# EAGLE design BuckConverterSchematic (EAGLE 9.2.0)
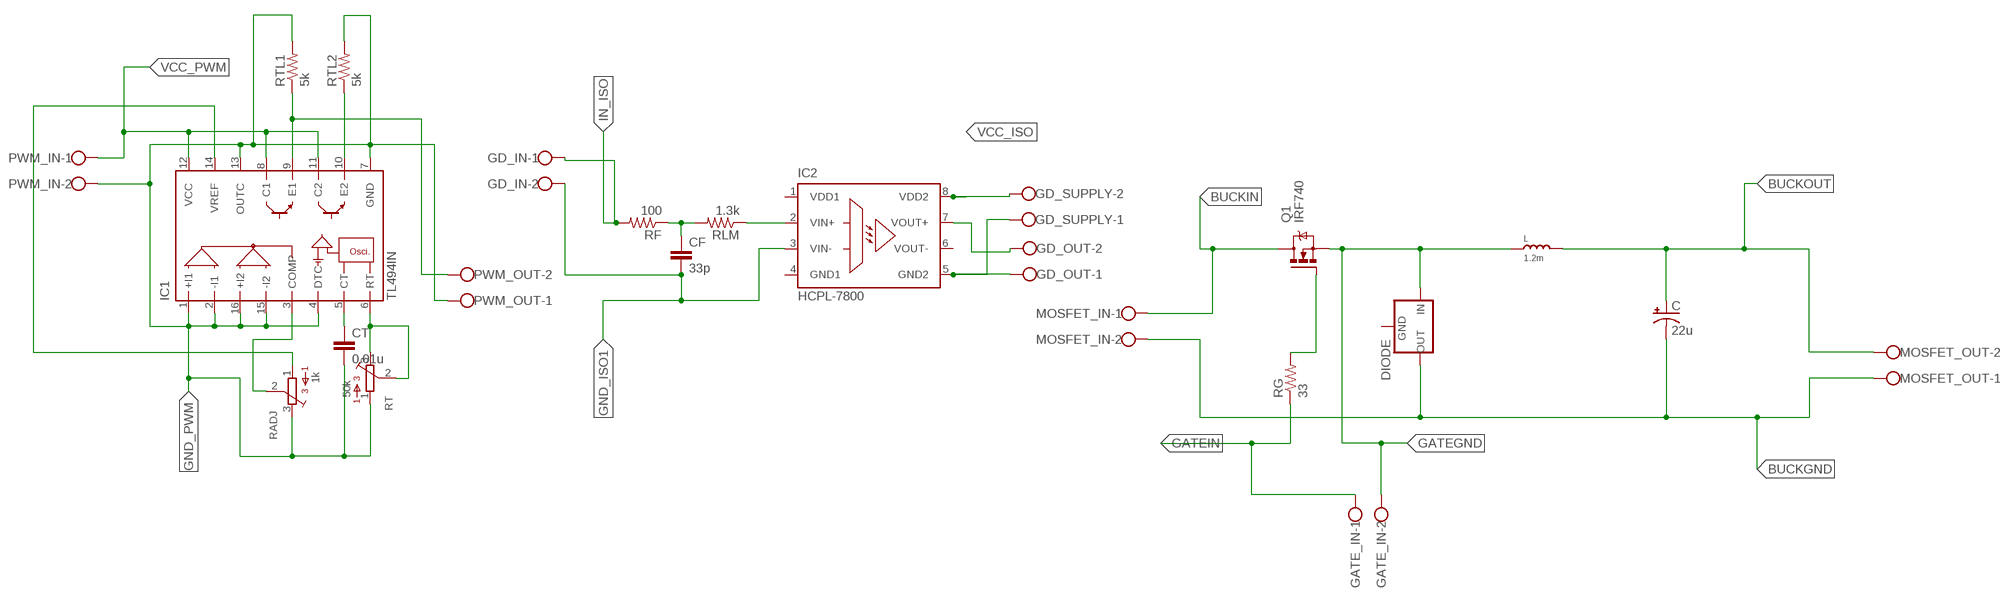
[diagram p0: schematic, sheet 1]

## Parts
C  22u  CPOL-USE2-5  [E2-5]
CF  33p  C-EU025-024X044  [C025-024X044]
CT  0.01u  C-EU025-024X044  [C025-024X044]
DIODE  78XXL  [78XXL]
GATE_IN  W237-102  [W237-102]
GD_IN  W237-102  [W237-102]
GD_OUT  W237-102  [W237-102]
GD_SUPPLY  W237-102  [W237-102]
IC1  TL494IN  [DIL16]
IC2  HCPL-7800  [DIL08]
L  1.2m  HIGH-FREQUENCY-POWER-INDUCTOR  [FERRITE-CORE-INDUCTOR]
MOSFET_IN  W237-102  [W237-102]
MOSFET_OUT  W237-102  [W237-102]
PWM_IN  W237-102  [W237-102]
PWM_OUT  W237-102  [W237-102]
Q1  IRF740  [TO220BV]
RADJ  1k  3386-P  [3386P]
RF  100  R-US_0207/9  [0207/9]
RG  33  R-US_0411/15  [0411/15]
RLM  1.3k  R-US_0207/9  [0207/9]
RT  50k  3386-P  [3386P]
RTL1  5k  R-US_0207/9  [0207/9]
RTL2  5k  R-US_0207/9  [0207/9]

## Nets
BUCKGND: C.- DIODE.OUT MOSFET_IN.2 MOSFET_OUT.1
BUCKIN: MOSFET_IN.1 Q1.D
BUCKOUT: C.+ L.P$2(L2) MOSFET_OUT.2
GATEGND: DIODE.IN GATE_IN.2 L.P$1(L1) Q1.S
GATEIN: GATE_IN.1 RG.1
GND_ISO1: CF.2 GD_IN.2 IC2.3(VIN-)
GND_PWM: CT.2 IC1.1(+I1) IC1.2(-I1) IC1.4(DTC) IC1.7(GND) IC1.13(OUTC) IC1.15(-I2) IC1.16(+I2) PWM_IN.2 PWM_OUT.1 RADJ.3 RT.1 RTL1.2 RTL2.2
IN_ISO: GD_IN.1 RF.2
N$1: IC1.9(E1) PWM_OUT.2 RTL1.1
N$2: IC1.10(E2) RTL2.1
N$3: IC1.6(RT) RT.2 RT.3
N$4: IC1.3(COMP) RADJ.2
N$5: GD_OUT.1 GD_SUPPLY.1 IC2.5(GND2)
N$6: CT.1 IC1.5(CT)
N$8: GD_OUT.2 IC2.7(VOUT+)
N$9: IC1.14(VREF) RADJ.1
N$10: Q1.G RG.2
N$12: CF.1 RF.1 RLM.2
N$13: IC2.2(VIN+) RLM.1
VCC_ISO: GD_SUPPLY.2 IC2.8(VDD2)
VCC_PWM: IC1.8(C1) IC1.11(C2) IC1.12(VCC) PWM_IN.1
Unconnected: DIODE.GND

## Power pins joined to a net without a drawn wire
GND1: IC2.4(GND1)
VDD1: IC2.1(VDD1)
VOUT-: IC2.6(VOUT-)

## Library data of the parts
C = rcl:CPOL-US: POLARIZED CAPACITOR, American symbol; SPICEPREFIX: C
CF CT = rcl:C-EU: CAPACITOR, European symbol; SPICEPREFIX: C
DIODE = v-reg:78XXL: VOLTAGE REGULATOR
GATE_IN GD_IN GD_OUT GD_SUPPLY MOSFET_IN MOSFET_OUT PWM_IN PWM_OUT = con-wago-500:W237-102: WAGO SCREW CLAMP; MPN: 237-102; OC_FARNELL: unknown; OC_NEWARK: 70K9898
IC1 = linear:TL494*: SWITCHMODE Pulse Width Modulation Control Circuit NCV494B http://onsemi.com tl494-d.pdf
IC2 = avago:HCPL-7800: Isolation Amplifer Source: http://www.avagotech.com/docs/AV02-0410EN; MPN: HCPL-7800A#500; OC_FARNELL: 459446; OC_NEWARK: 05M6395
L = pepslab:HIGH-FREQUENCY-POWER-INDUCTOR
Q1 = transistor-power:IRF740: N-CHANNEL MOS FET
RADJ RT = bourns:3386-: 3386 Series 3/8" Square Trimmer
RF RG RLM RTL1 RTL2 = adafruit:R-US_: RESISTOR, American symbol

## Board
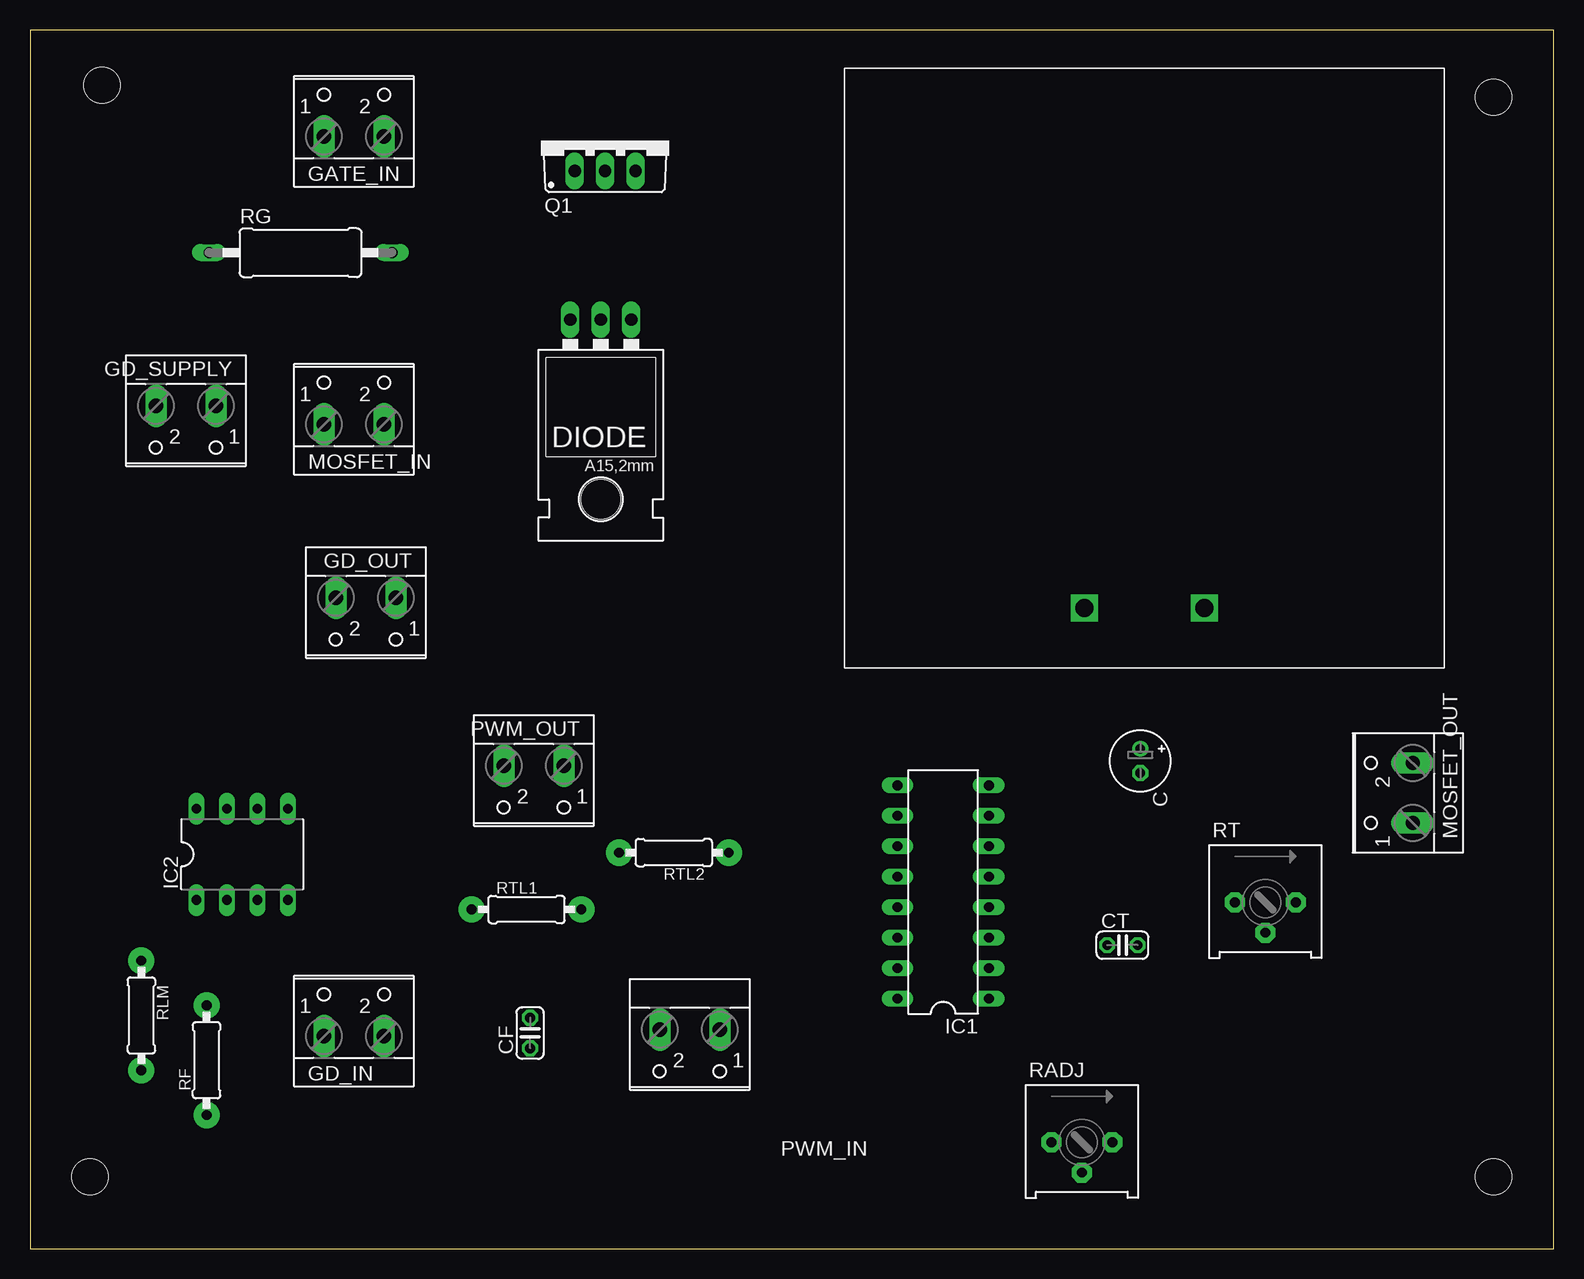
[diagram p1: board, top side]
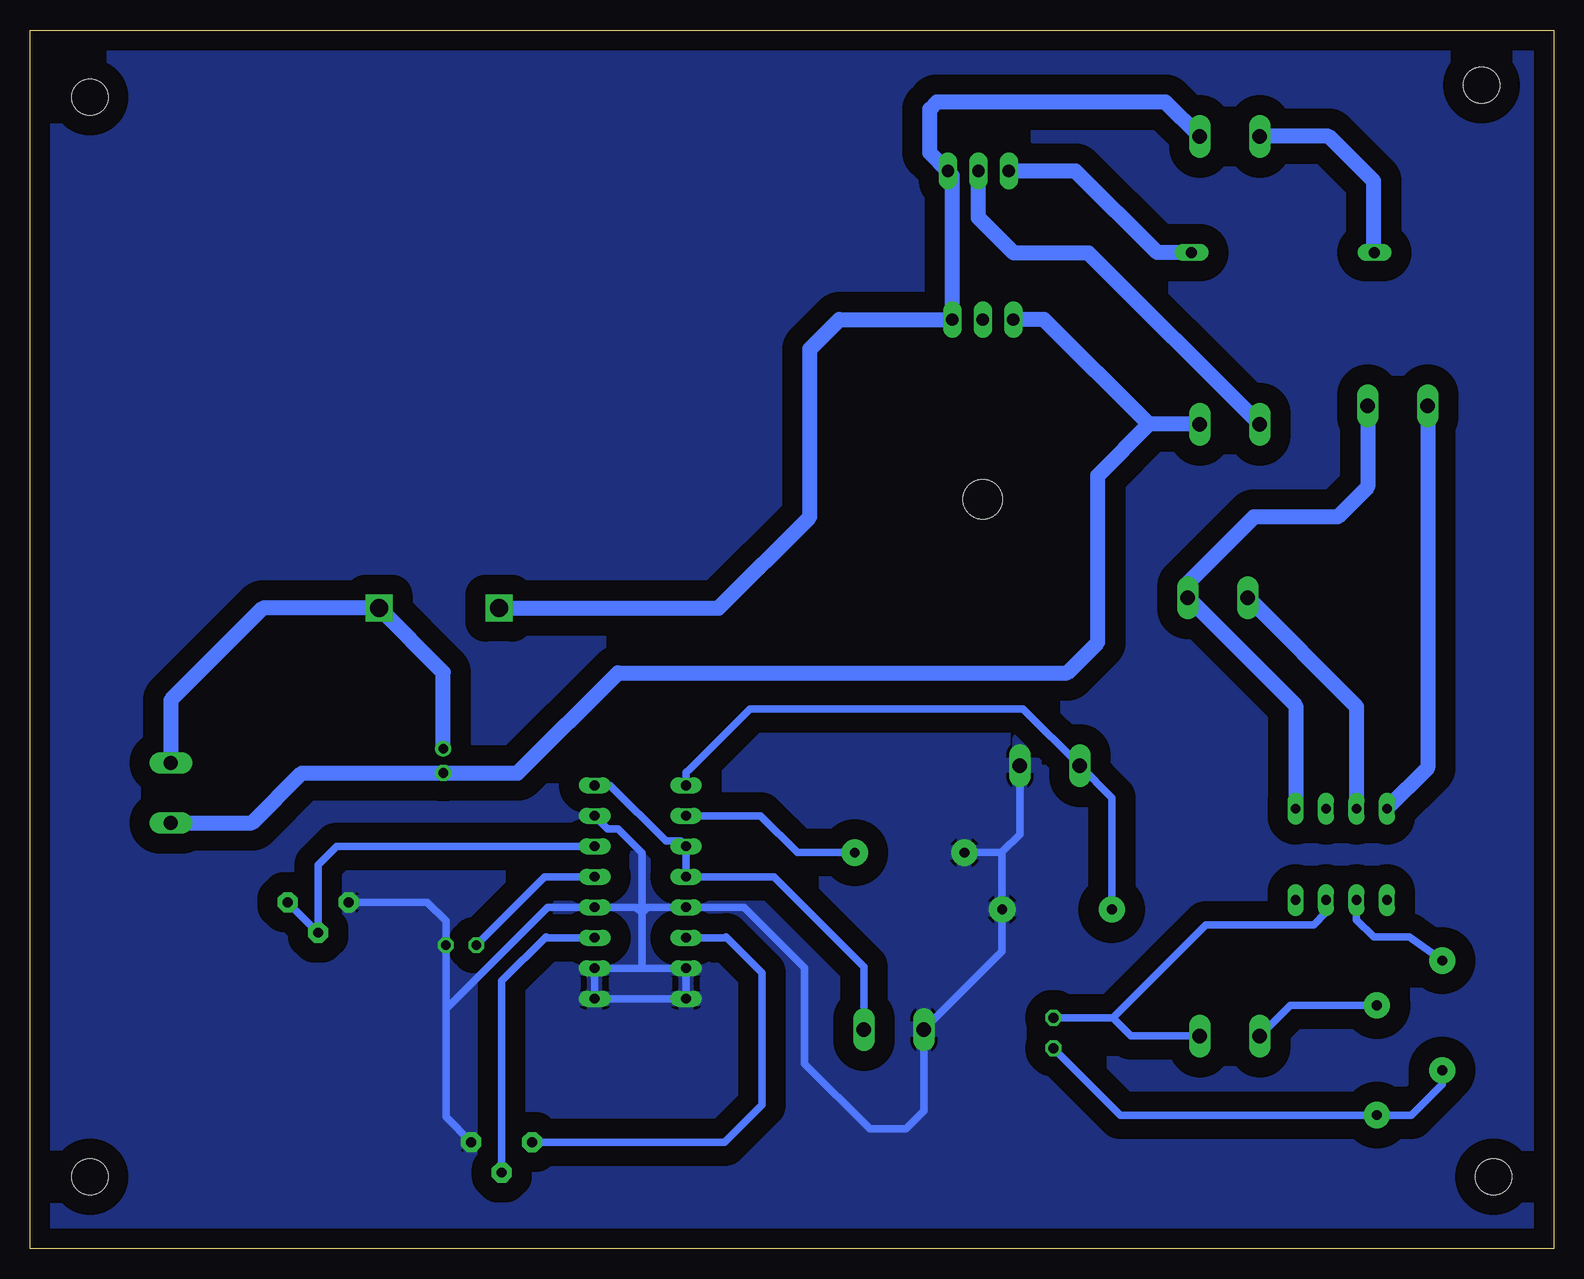
[diagram p2: board, bottom side, seen from below]

Size 127 x 101.6 mm. Coordinates in mm from the lower left corner, seen from the top.
Outline: 0,0 127,0 127,101.6 0,101.6 0,0
Copper layers (1*16): Top 0.035mm / dielectric 1.5mm / Bottom 0.035mm
Design rules "default": minimum track width 6mil, minimum drill 0.35mm, track to track 6mil, track to pad 6mil, pad to pad 6mil, via to via 6mil, smd to smd 6mil, copper to edge 40mil, drill to drill 6mil, minimum pad ring 10mil, minimum via ring 8mil, stop-mask expansion 4mil, vias tented up to drill 0mil, thermal gap 10mil
Holes 3 mm at 6,97 122,96 122,6 5,6

### Footprints (pad centres in the part's own frame; a part is rotated, then mirrored left to right if it is on the bottom)
E2-5 = drill 0.813 pad 1.27: + -1.016,0 | drill 0.813 pad 1.27 octagon: - 1.016,0
C025-024X044 = drill 0.813 octagon: 1 -1.27,0; 2 1.27,0
78XXL = drill 1.016 long: GND 0,-3.81; IN -2.54,-3.81; OUT 2.54,-3.81 | hole 3.302: 0,11.176
W237-102 = drill 1.194 long: 1 -2.5,-1.27; 2 2.5,-1.27
DIL16 = drill 0.813 long: 1 -8.89,-3.81; 2 -6.35,-3.81; 3 -3.81,-3.81; 4 -1.27,-3.81; 5 1.27,-3.81; 6 3.81,-3.81; 7 6.35,-3.81; 8 8.89,-3.81; 9 8.89,3.81; 10 6.35,3.81; 11 3.81,3.81; 12 1.27,3.81; 13 -1.27,3.81; 14 -3.81,3.81; 15 -6.35,3.81; 16 -8.89,3.81
DIL08 = drill 0.813 pad 1.3 long: 1 -3.81,-3.81; 2 -1.27,-3.81; 3 1.27,-3.81; 4 3.81,-3.81; 5 3.81,3.81; 6 1.27,3.81; 7 -1.27,3.81; 8 -3.81,3.81
FERRITE-CORE-INDUCTOR = drill 1.5 square: P$1 -5,-20; P$2 5,-20
TO220BV = drill 1.016 long: D 0,-2.54; G -2.54,-2.54; S 2.54,-2.54
3386P = drill 0.813 pad 1.676 octagon: 1 -2.54,0; 2 0,-2.54; 3 2.54,0
0207/9 = drill 0.813 pad 2.184: 1 -4.572,0; 2 4.572,0
0411/15 = drill 0.914 long: 1 -7.62,0; 2 7.62,0

### Placement (x,y rotation side)
C  92.55,40.67 270 top
CF  41.69,17.98 90 top
CT  91.06,25.31 0 top
DIODE  47.58,73.65 180 top
GATE_IN  27,94 0 top
GD_IN  27,19 0 top
GD_OUT  28,53 180 top
GD_SUPPLY  13,69 180 top
IC1  76.12,29.74 90 top
IC2  17.69,32.88 0 top
L  92.9,73.4 0 top
MOSFET_IN  27,70 0 top
MOSFET_OUT  114,38 90 top
PWM_IN  55,17 180 top
PWM_OUT  42,39 180 top
Q1  47.95,92.39 0 top
RADJ  87.68,8.88 0 top
RF  14.72,15.71 90 top
RG  22.55,83.04 0 top
RLM  9.28,19.45 270 top
RT  102.98,28.88 0 top
RTL1  41.39,28.28 0 top
RTL2  53.67,33.02 180 top

### Tracks (layer width: path | path; a pad name or v marks a point on that pad's centre or on a via)
BUCKGND
  Bottom 1.27: MOSFET_IN.2 33.73,68.73 | DIODE.OUT 42.46,77.46 33.73,68.73 | 33.73,68.73 38,64.46 38,50.54 40.54,48 78,48 86.35,39.65 C.- 104.35,39.65 108.5,35.5 MOSFET_OUT.1
BUCKIN
  Bottom 1.27: Q1.D 47.95,85.95 45,83 38.77,83 MOSFET_IN.1
BUCKOUT
  Bottom 1.27: MOSFET_OUT.2 115.27,45.73 107.6,53.4 L.P$2 92.55,48.05 C.+
GATEGND
  Bottom 1.27: Q1.S 50.12,89.48 DIODE.IN 59.54,77.46 62,75 62,61 69.6,53.4 L.P$1 | 51,90.36 Q1.S | Q1.S 52,91.36 52,95 51.42,95.58 32.35,95.58 GATE_IN.2
GATEIN
  Bottom 1.27: RG.1 15,83.11 15,89 18.73,92.73 GATE_IN.1
GND_ISO1
  Bottom 0.61: IC2.3 18.96,28.04 20,27 29,27 36.75,19.25 | CF.2 36.75,19.25 | GD_IN.2 35.23,17.73 36.75,19.25
GND_PWM
  Bottom 0.61: 76,23.39 IC1.2 IC1.1 IC1.16 IC1.15 76,23.39 | RADJ.3 92.33,10.99 92.33,20 | 92.33,20 CT.2 92.33,27.33 93.88,28.88 RT.1 | 92.33,20 83.86,28.47 IC1.4 76.47,28.47 76,28 | 76,28 75.53,28.47 IC1.13 67.47,28.47 62.43,23.43 62.43,15.43 57,10 54,10 52.5,11.5 PWM_IN.2 45.96,24.81 RTL1.2 45.96,33.09 | 76,28 76,23.39 | IC1.7 78.84,35 78,35 76,33 76,28 | RTL2.2 46.03,33.02 45.96,33.09 | PWM_OUT.1 44.5,34.55 45.96,33.09
  pour Bottom (isolate 1.676): 2,2 2,100 126,100 126,2
IN_ISO
  Bottom 0.61: RF.2 21.95,20.28 GD_IN.1
N$1
  Bottom 0.61: IC1.9 72.31,39.69 72,40 71,41 67,45 44.23,45 PWM_OUT.2 36.82,37.59 RTL1.1
N$2
  Bottom 0.61: IC1.10 66.09,36.09 63.02,33.02 RTL2.1
N$3
  Bottom 0.61: IC1.6 101.45,33.55 103,32 102.98,31.98 RT.2 RT.3
N$4
  Bottom 0.61: RADJ.2 87.68,22.32 84,26 83.93,25.93 IC1.3
N$5
  Bottom 1.27: IC2.5 21.5,45.27 GD_OUT.1 30.5,55.5 25,61 18,61 15.5,63.5 GD_SUPPLY.1
N$6
  Bottom 0.61: IC1.5 84.09,31.01 CT.1
N$8
  Bottom 1.27: GD_OUT.2 16.42,45.19 IC2.7
N$9
  Bottom 0.61: IC1.14 69.07,25.93 69,26 66,23 66,12 69.12,8.88 RADJ.1
N$10
  Bottom 1.27: RG.2 33.04,83.04 39.85,89.85 Q1.G
N$12
  Bottom 0.61: 9.28,14.72 RLM.2 9.28,13.72 11.86,11.14 RF.1 36.12,11.14 CF.1
N$13
  Bottom 0.61: RLM.1 12.02,26 15,26 16.42,27.42 IC2.2
VCC_ISO
  Bottom 1.27: GD_SUPPLY.2 10.5,40.07 IC2.8
VCC_PWM
  Bottom 0.61: IC1.8 78.63,38.63 74,34 72.76,34 IC1.11 IC1.12 65,31.01 57.5,23.51 PWM_IN.1